# Altium schematic sheet 05-WPT.SchDoc: Wireless Power Transfer
size A2; DocumentNumber: 5; SheetNumber: 5; SheetTotal: 15
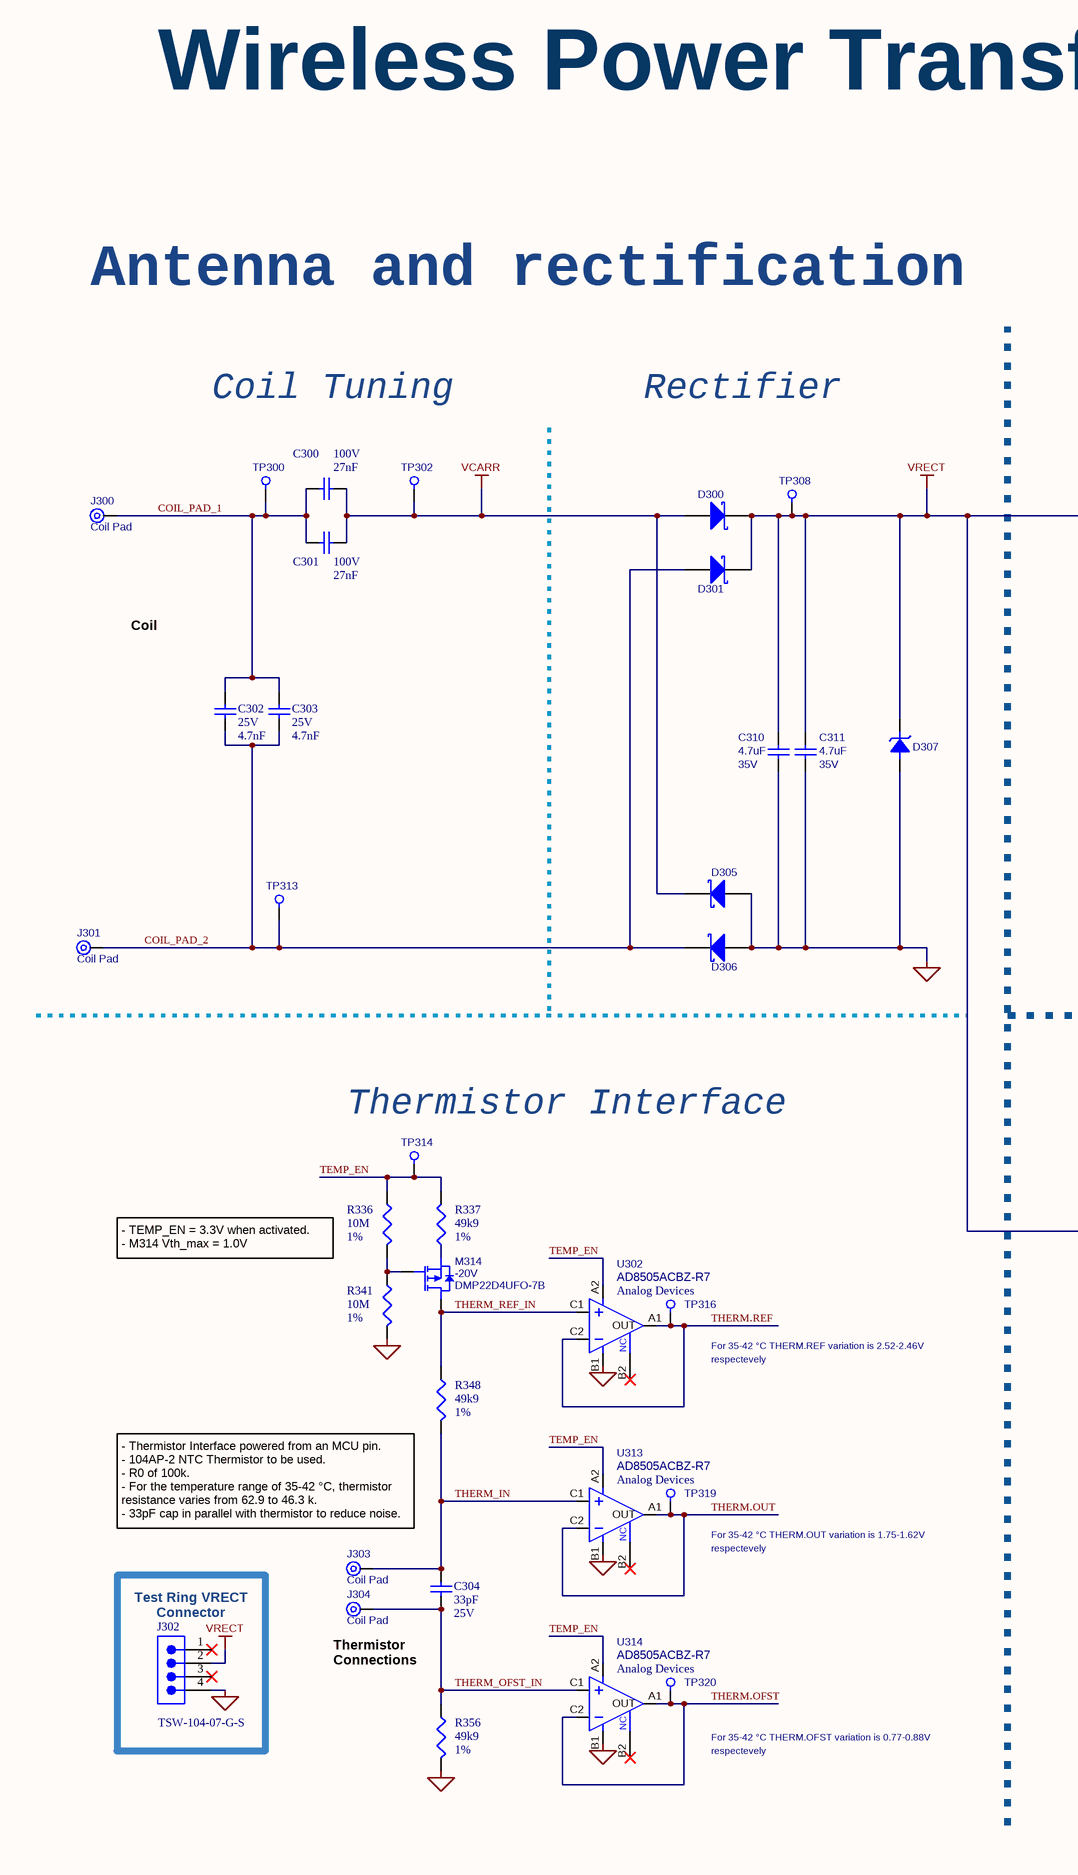
[diagram p0: 05-WPT.SchDoc, left]
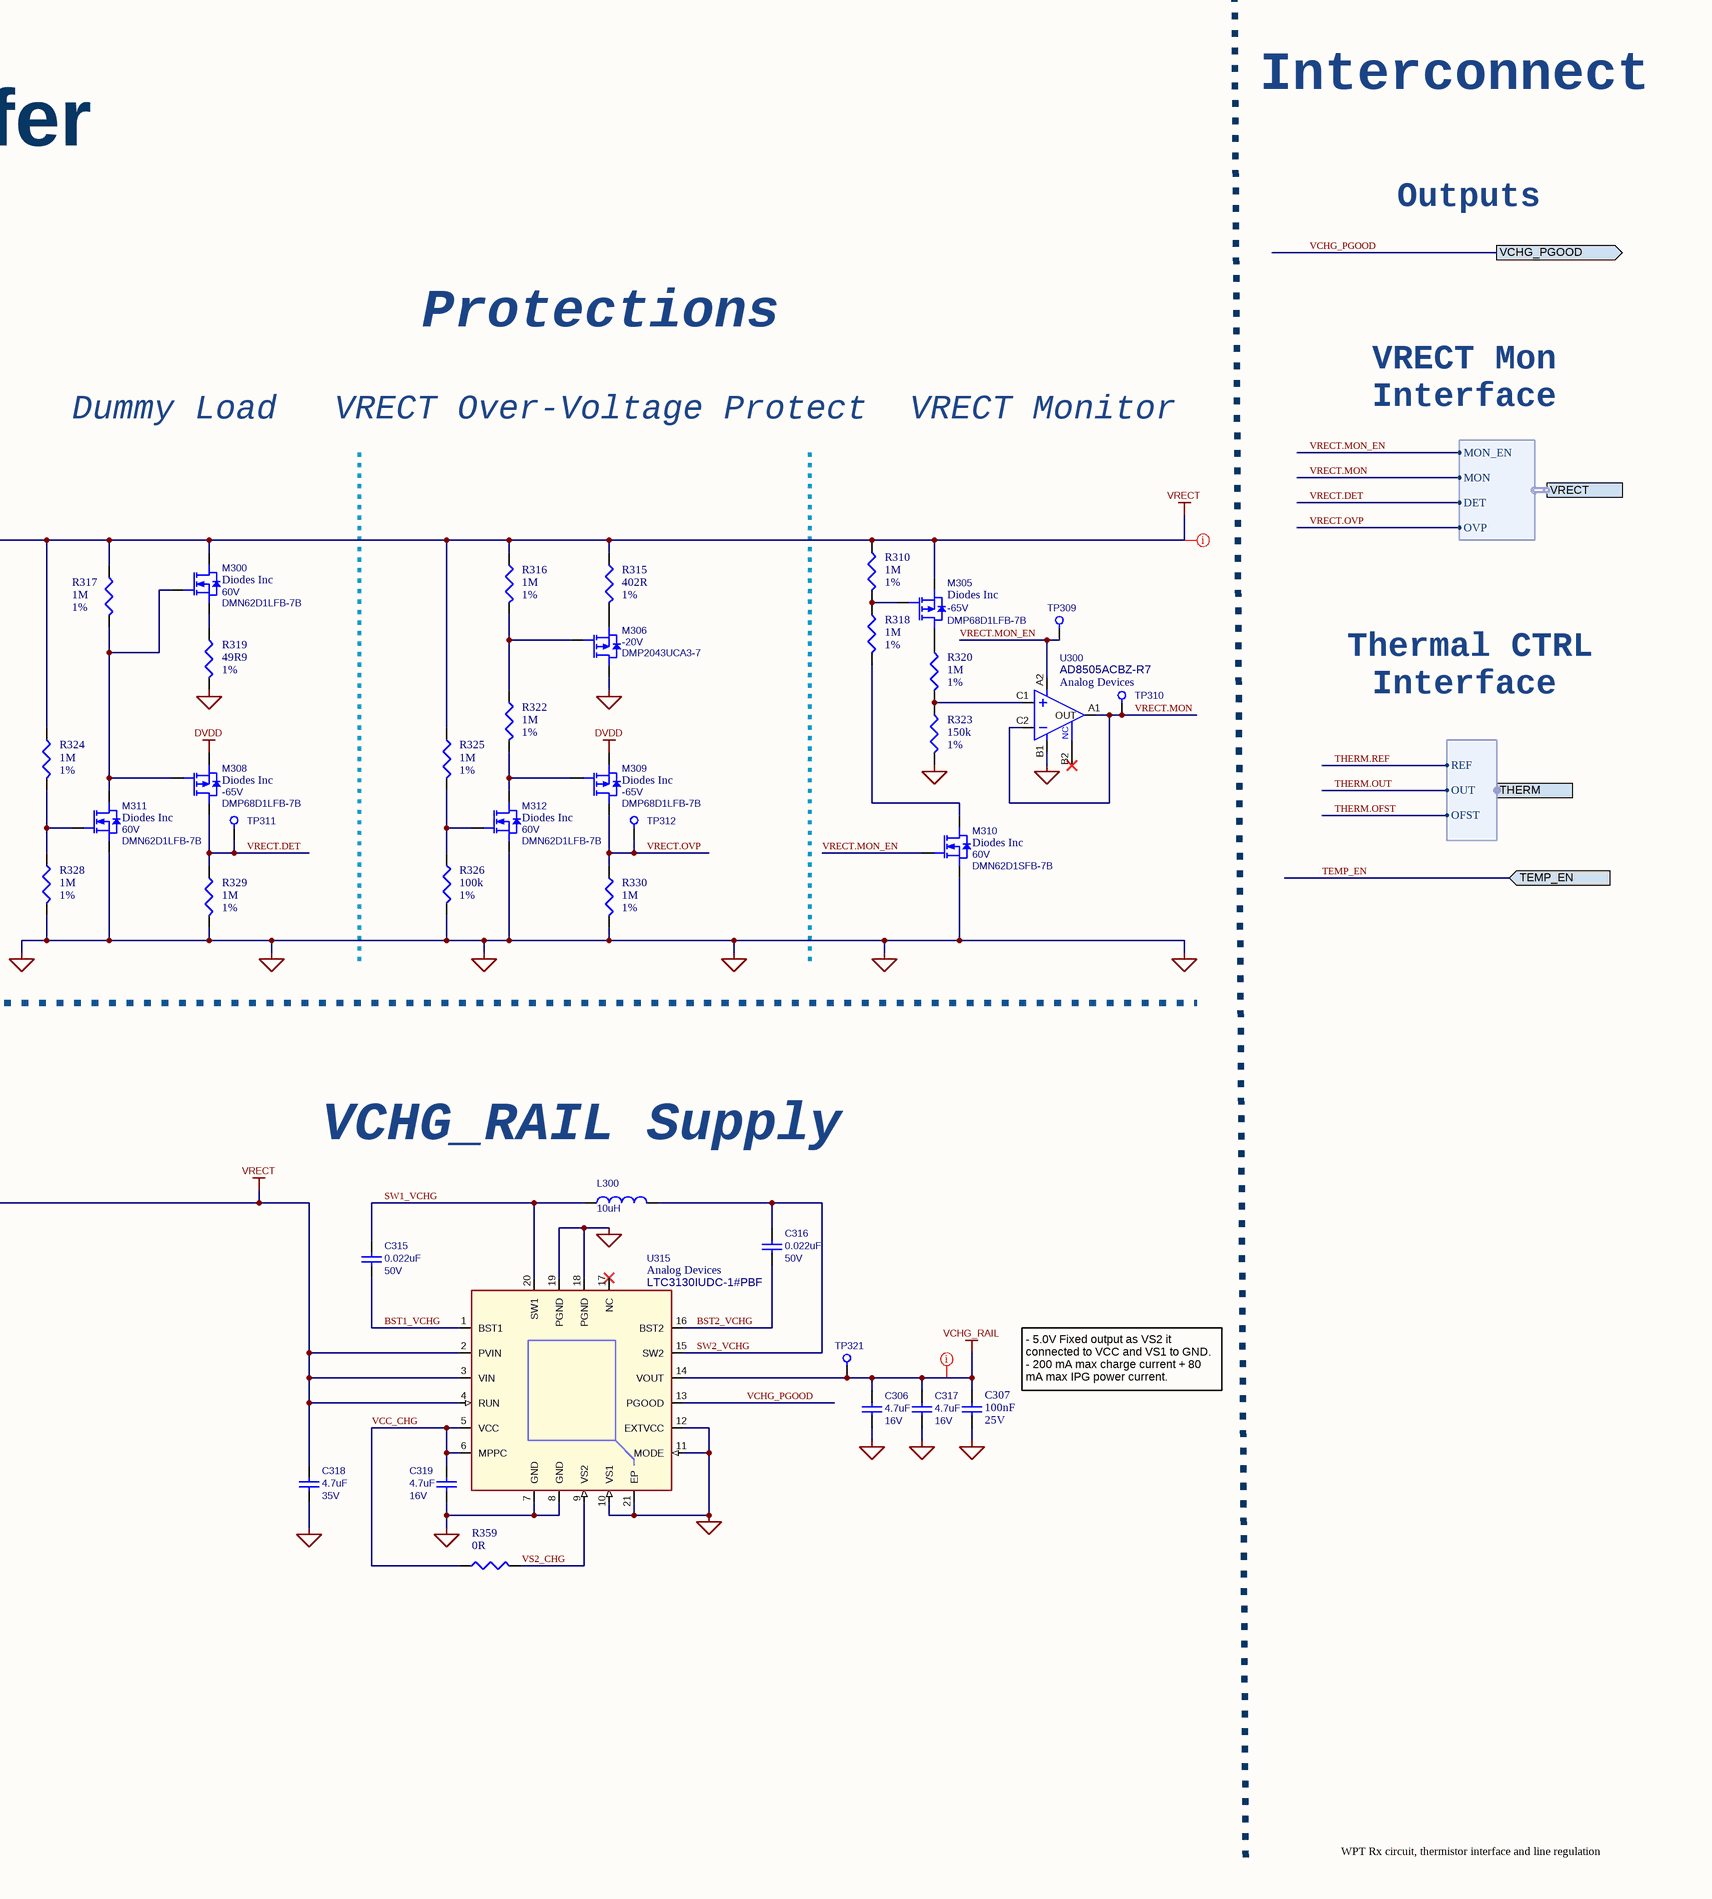
[diagram p1: 05-WPT.SchDoc, right]

## Parts
C300  value 27nF  Voltage Rating: 100V  [CAP0805_REDUCED]  (hidden comment: GRM2195C2A273GE01D)
C301  value 27nF  Voltage Rating: 100V  [CAP0805_REDUCED]  (hidden comment: GRM2195C2A273GE01D)
C302  value 4.7nF  Voltage Rating: 25V  [CAP0603_REDUCED]  (hidden comment: C0603C472F3GECTU)
C303  value 4.7nF  Voltage Rating: 25V  [CAP0603_REDUCED]  (hidden comment: C0603C472F3GECTU)
C304  value 33pF  Rated DC Voltage (URdc): 25V  [C0201_C]  (hidden comment: GRM0335C1E330JA01D)
C306  value 4.7uF  Rating: 16V  [CAP0603_REDUCED]  (hidden comment: GRM188R61C475KE11)
C307  value 100nF  Rated DC Voltage (URdc): 25V  [C0201_C]  (hidden comment: GRM033R61E104KE14J)
C310  value 4.7uF  Rating: 35V  [CAP0805_REDUCED]  (hidden comment: GCM21BC7YA475KE36L)
C311  value 4.7uF  Rating: 35V  [CAP0805_REDUCED]  (hidden comment: GCM21BC7YA475KE36L)
C315  value 0.022uF  Rating: 50V  [CAP0402_REDUCED]  (hidden comment: GCM155R71H223KA55D)
C316  value 0.022uF  Rating: 50V  [CAP0402_REDUCED]  (hidden comment: GCM155R71H223KA55D)
C317  value 4.7uF  Rating: 16V  [CAP0603_REDUCED]  (hidden comment: GRM188R61C475KE11)
C318  value 4.7uF  Rating: 35V  [CAP0805_REDUCED]  (hidden comment: GCM21BC7YA475KE36L)
C319  value 4.7uF  Rating: 16V  [CAP0603_REDUCED]  (hidden comment: GRM188R61C475KE11)
D300  NSR05T40XV2T5G  [STM_SOD-523_R]  (value not drawn)
D301  NSR05T40XV2T5G  [STM_SOD-523_R]  (value not drawn)
D305  NSR05T40XV2T5G  [STM_SOD-523_R]  (value not drawn)
D306  NSR05T40XV2T5G  [STM_SOD-523_R]  (value not drawn)
D307  BZX884B10L-G3-08  [DFN1006-2A]  (value not drawn)
J300  Coil Pad  [FEEDHOLE_20mil]  (no BOM)
J301  Coil Pad  [FEEDHOLE_20mil]  (no BOM)
J302  TSW-104-07-G-S  [SMTC-TSW-104-07-X-S]
J303  Coil Pad  [FEEDHOLE_20mil]  (no BOM)
J304  Coil Pad  [FEEDHOLE_20mil]  (no BOM)
L300  value 10uH  [WURTH_74438323100_REDUCED]  (hidden comment: 74438323100)
M300  Manufacturer: Diodes Inc  Rating: 60V  [DIODESINC_X1-DFN1006-3]  (hidden comment: DMN62D1LFB-7B)
M305  Manufacturer: Diodes Inc  Rating: -65V  [DIODESINC_X1-DFN1006-3]  (hidden comment: DMP68D1LFB-7B)
M306  Rating: -20V  [DIODESINC_X2-DSN1010-3_CUSTOMPIN]  (hidden comment: DMP2043UCA3-7)
M308  Manufacturer: Diodes Inc  Rating: -65V  [DIODESINC_X1-DFN1006-3]  (hidden comment: DMP68D1LFB-7B)
M309  Manufacturer: Diodes Inc  Rating: -65V  [DIODESINC_X1-DFN1006-3]  (hidden comment: DMP68D1LFB-7B)
M310  Manufacturer: Diodes Inc  Rating: 60V  [DIODESINC_X1-DFN1006-3]  (hidden comment: DMN62D1SFB-7B)
M311  Manufacturer: Diodes Inc  Rating: 60V  [DIODESINC_X1-DFN1006-3]  (hidden comment: DMN62D1LFB-7B)
M312  Manufacturer: Diodes Inc  Rating: 60V  [DIODESINC_X1-DFN1006-3]  (hidden comment: DMN62D1LFB-7B)
M314  Rating: -20V  [DIODESINC_X2-DFN0604-3]  (hidden comment: DMP22D4UFO-7B)
R310  value 1M  Tolerance: 1%  [R0201_C]  (hidden comment: CRCW02011M00FNED)
R315  value 402R  Tolerance: 1%  [R0201_C]  (hidden comment: CRCW0201402RFNED)
R316  value 1M  Tolerance: 1%  [R0201_C]  (hidden comment: CRCW02011M00FNED)
R317  value 1M  Tolerance: 1%  [R0201_C]  (hidden comment: CRCW02011M00FNED)
R318  value 1M  Tolerance: 1%  [R0201_C]  (hidden comment: CRCW02011M00FNED)
R319  value 49R9  Tolerance: 1%  [R0201_C]  (hidden comment: CRCW020149R9FNED)
R320  value 1M  Tolerance: 1%  [R0201_C]  (hidden comment: CRCW02011M00FNED)
R322  value 1M  Tolerance: 1%  [R0201_C]  (hidden comment: CRCW02011M00FNED)
R323  value 150k  Tolerance: 1%  [R0201_C]  (hidden comment: CRCW0201150KFNED)
R324  value 1M  Tolerance: 1%  [R0201_C]  (hidden comment: CRCW02011M00FNED)
R325  value 1M  Tolerance: 1%  [R0201_C]  (hidden comment: CRCW02011M00FNED)
R326  value 100k  Tolerance: 1%  [R0201_C]  (hidden comment: CRCW0201100KFNED)
R328  value 1M  Tolerance: 1%  [R0201_C]  (hidden comment: CRCW02011M00FNED)
R329  value 1M  Tolerance: 1%  [R0201_C]  (hidden comment: CRCW02011M00FNED)
R330  value 1M  Tolerance: 1%  [R0201_C]  (hidden comment: CRCW02011M00FNED)
R336  value 10M  Tolerance: 1%  [R0201_C]  (hidden comment: CRCW020110M0FNED)
R337  value 49k9  Tolerance: 1%  [R0201_C]  (hidden comment: CRCW020149K9FNED)
R341  value 10M  Tolerance: 1%  [R0201_C]  (hidden comment: CRCW020110M0FNED)
R348  value 49k9  Tolerance: 1%  [R0201_C]  (hidden comment: CRCW020149K9FNED)
R356  value 49k9  Tolerance: 1%  [R0201_C]  (hidden comment: CRCW020149K9FNED)
R359  value 0R  [R0201_C]  (hidden comment: CRCW02010000Z0ED)
TP300  Test Point  [testpad_0.9mm]  (value not drawn)  (no BOM)
TP302  Test Point  [testpad_0.9mm]  (value not drawn)  (no BOM)
TP308  Test Point  [testpad_0.9mm]  (value not drawn)  (no BOM)
TP309  Test Point  [testpad_0.9mm]  (value not drawn)  (no BOM)
TP310  Test Point  [testpad_0.9mm]  (value not drawn)  (no BOM)
TP311  Test Point  [testpad_0.9mm]  (value not drawn)  (no BOM)
TP312  Test Point  [testpad_0.9mm]  (value not drawn)  (no BOM)
TP313  Test Point  [testpad_0.9mm]  (value not drawn)  (no BOM)
TP314  Test Point  [testpad_0.9mm]  (value not drawn)  (no BOM)
TP316  Test Point  [testpad_0.9mm]  (value not drawn)  (no BOM)
TP319  Test Point  [testpad_0.9mm]  (value not drawn)  (no BOM)
TP320  Test Point  [testpad_0.9mm]  (value not drawn)  (no BOM)
TP321  Test Point  [testpad_0.9mm]  (value not drawn)  (no BOM)
U300  Manufacturer: Analog Devices  [AD8505ACBZ-R7]  (hidden comment: AD8505ACBZ-R7)
U302  Manufacturer: Analog Devices  [AD8505ACBZ-R7]  (hidden comment: AD8505ACBZ-R7)
U313  Manufacturer: Analog Devices  [AD8505ACBZ-R7]  (hidden comment: AD8505ACBZ-R7)
U314  Manufacturer: Analog Devices  [AD8505ACBZ-R7]  (hidden comment: AD8505ACBZ-R7)
U315  Manufacturer: Analog Devices  [LT_UDC-20_REDUCED]  (hidden comment: LTC3130IUDC-1#PBF)

## Ports
TEMP_EN (in), THERM (harness THERMAL CTRL), VCHG_PGOOD (out), VRECT (harness VRECT MON)

## Harnesses
THERMAL CTRL: REF, OUT, OFST
VRECT MON: OVP, DET, MON, MON_EN

## Nets
DVDD: M308.2(S) M309.2(S)
GND: C306.2 C307.1 C310.1 C311.1 C317.2 C318.1 C319.2 D305.2(A) D306.2(A) D307.1 J302.4 M306.1(D) M310.2(S) M311.2(S) M312.2(S) R319.2 R323.2 R326.2 R328.2 R329.2 R330.2 R341.2 R356.2 U300.B1(V-) U302.B1(V-) U313.B1(V-) U314.B1(V-) U315.7(GND) U315.8(GND) U315.10(VS1) U315.11(MODE) U315.12(EXTVCC) U315.18(PGND) U315.19(PGND) U315.21(EP)
VCARR: C300.2 C301.2 D300.2(A) D305.1(K) TP302.1
VCHG_RAIL: C306.1 C307.2 C317.1 TP321.1 U315.14(VOUT)
VRECT: C310.2 C311.2 C318.2 D300.1(K) D301.1(K) D307.2 J302.2 M300.3(D) M305.2(S) R310.1 R315.1 R316.1 R317.1 R324.1 R325.1 TP308.1 U315.2(PVIN) U315.3(VIN) U315.4(RUN)
BST1_VCHG: C315.1 U315.1(BST1)
BST2_VCHG: C316.1 U315.16(BST2)
COIL_PAD_1: C300.1 C301.1 C302.2 C303.2 J300.1 TP300.1
COIL_PAD_2: C302.1 C303.1 D301.2(A) D306.1(K) J301.1 TP313.1
SW1_VCHG: C315.2 L300.1 U315.20(SW1)
SW2_VCHG: C316.2 L300.2 U315.15(SW2)
TEMP_EN: R336.1 R337.2 TP314.1 U302.A2(V+) U313.A2(V+) U314.A2(V+) ; port TEMP_EN
THERM.OFST: TP320.1 U314.A1(OUT) U314.C2(IN-) ; port THERM.OFST
THERM.OUT: TP319.1 U313.A1(OUT) U313.C2(IN-) ; port THERM.OUT
THERM.REF: TP316.1 U302.A1(OUT) U302.C2(IN-) ; port THERM.REF
THERM_IN: C304.2 J303.1 R348.2 U313.C1(IN+)
THERM_OFST_IN: C304.1 J304.1 R356.1 U314.C1(IN+)
THERM_REF_IN: M314.3(D) R348.1 U302.C1(IN+)
VCC_CHG: C319.1 R359.1 U315.5(VCC) U315.6(MPPC)
VCHG_PGOOD: U315.13(PGOOD) ; port VCHG_PGOOD
VRECT.DET: M308.3(D) R329.1 TP311.1 ; port VRECT.DET
VRECT.MON: TP310.1 U300.A1(OUT) U300.C2(IN-) ; port VRECT.MON
VRECT.MON_EN: M310.1(G) TP309.1 U300.A2(V+) ; port VRECT.MON_EN
VRECT.OVP: M309.3(D) R330.1 TP312.1 ; port VRECT.OVP
VS2_CHG: R359.2 U315.9(VS2)
NetM300_1: M300.1(G) M308.1(G) M311.3(D) R317.2
NetM300_2: M300.2(S) R319.1
NetM305_1: M305.1(G) R310.2 R318.1
NetM305_3: M305.3(D) R320.1
NetM306_2: M306.2(G) R316.2 R322.1
NetM306_3: M306.3(S) R315.2
NetM309_1: M309.1(G) M312.3(D) R322.2
NetM310_3: M310.3(D) R318.2
NetM311_1: M311.1(G) R324.2 R328.1
NetM312_1: M312.1(G) R325.2 R326.1
NetM314_1: M314.1(G) R336.2 R341.1
NetM314_2: M314.2(S) R337.1
NetR320_2: R320.2 R323.1 U300.C1(IN+)

Not connected (* = marked no-connect by the designer): J302 1* 3*; U300 B2(NC)*; U302 B2(NC)*; U313 B2(NC)*; U314 B2(NC)*; U315 17(NC)*

## Layout directives
rule Supply Nets [Voltage = 5.000]; net class POWER: VCHG_RAIL
net class POWER; Voltage: 0-11V: VRECT

## Notes on the sheet
- Interconnect
- Wireless Power Transfer
- Outputs
- Antenna and rectification
- Protections
- Dummy Load
- VRECT Over-Voltage Protect
- VRECT Monitor
- VRECT Mon
- Interface
- Coil Tuning
- Rectifier
- Coil
  Connections
- Thermal CTRL
- (near TP314) Thermistor Interface
- VCHG_RAIL Supply
- - TEMP_EN = 3.3V when activated.
  - M314 Vth_max = 1.0V
- For 35-42 °C THERM.REF variation is 2.52-2.46V
- respectevely
- - 5.0V Fixed output as VS2 it connected to VCC and VS1 to GND.
  - 200 mA max charge current + 80 mA max IPG power current.
- - Thermistor Interface powered from an MCU pin.
  - 104AP-2 NTC Thermistor to be used.
  - R0 of 100k.
  - For the temperature range of 35-42 °C, thermistor resistance varies from 62.9 to 46.3 k.
  - 33pF cap in parallel with thermistor to reduce noise.
- For 35-42 °C THERM.OUT variation is 1.75-1.62V
- (near J302) Test Ring VRECT
  Connector
- Thermistor
  Connections
- For 35-42 °C THERM.OFST variation is 0.77-0.88V
- WPT Rx circuit, thermistor interface and line regulation
- Project:
- Schematic:
- Design by:
- Date:
- Ver:
- .
- Comments:
- Reviewed by:

## Library data of the parts
C300 C301 = GRM2195C2A273GE01D: Capacitor, 27nF, C0G, 100VDC, 2%, 0805, Implant-grade; Manufacturer: Murata; Medical Grade Manufacturer: TBD; Category: Capacitor; Temperature Coefficient: -; Manufacturer Part Number: GRM2195C2A273GE01D; Medical Grade Manufacturer Part Number: TBD; Size Code: Size Code; Supplier: TBD; Supplier Part Number: 0.85mm; Height: 1.25mm; Width: 1.25mm; Length: 2mm; Tolerance: 2%; Dielectric: C0G; Supplier 1: Mouser; Supplier Part Number 1: 81-GRM2195C2A273GE1D; Supplier 2: Digikey; Supplier Part Number 2: 490-GRM2195C2A273GE01DCT-ND; Supplier 3: Digikey; Supplier Part Number 3: 490-GRM2195C2A273GE01DDKR-ND; Supplier 4: Digikey; Supplier Part Number 4: 490-GRM2195C2A273GE01DTR-ND
C302 C303 = C0603C472F3GECTU: Capacitor, 4.7nF, C0G, 25V, 1%, 0603, Implant-grade; Manufacturer: KEMET; Medical Grade Manufacturer: TBD; Category: Capacitor; Temperature Coefficient: -; Manufacturer Part Number: C0603C472F3GECTU; Medical Grade Manufacturer Part Number: TBD; Size Code: 0805; Supplier: -; Supplier Part Number: -; Height: 0.78mm; Width: 1.25mm; Length: 2mm; Tolerance: 1%; Dielectric: C0G; Supplier 1: Mouser; Supplier Part Number 1: 80-C0603C472F3GEC
C304 = GRM0335C1E330JA01D: Ceramic Capacitor, Multilayer, Ceramic, 25V, 5% +Tol, 5% -Tol, C0G, 30ppm/Cel TC, 0.000033uF, Surface Mount, 0201; Manufacturer: Murata; Multilayer: Yes; Supplier: Digikey; Supplier Part Number: 490-10678-1-ND; Manufacturer Part Number: GRM0335C1E330JA01D; RoHS: Yes; Category: Ceramic Capacitors; Stock: 355128; Pricing: 1=0,1, 10=0,011, 50=0,0062, 100=0,0048, 500=0,0036, 1000=0,00283, 2500=0,00258, 5000=0,00237 (USD); Mounting Technology: Surface Mount; Pins: 2; Dielectric Material: Ceramic; Package Shape: Rectangular; Case/Package: 0201; Terminal Finish: Nickel; Min Operating Temperature: -55°C; Max Operating Temperature: 125°C; JESD-609 Code: e3; Capacitor Type: Ceramic; Tolerance  (fill in as +-): 5%; Package Style: SMTMeter; Packaging: Tape and Reel; Tolerance (fill in as +-): 5%; Temperature Characteristics Code: C0G; Termination: Wraparound; Length: 0.6mm; Width: 0.3mm; Height: 0.3mm; Reach SVHC Compliant: Yes; RoHS Compliant: Yes; ComponentLink1URL: https://datasheet.ciiva.com:443/pdfs/VipMasterIC/IC/MURE/MURE-S-A0004347008/MURE-S-A0004347461-1.pdf?src-supplier=IHS+Markit; ComponentLink1Description: https://datasheet.ciiva.com:443/pdfs/VipMasterIC/IC/MURE/MURE-S-A0004347008/MURE-S-A0004347461-1.pdf?src-supplier=IHS+Markit; ComponentLink2URL: https://datasheet.ciiva.com/29538/partnumbering-e-01-29538933.pdf?src-supplier=Digikey; ComponentLink2Description: https://datasheet.ciiva.com/29538/partnumbering-e-01-29538933.pdf?src-supplier=Digikey; Supplier 1: Arrow Electronics; Supplier Part Number 1: GRM0335C1E330JA01D
C306 C317 C319 = GRM188R61C475KE11: Capacitor, 4.7uF, X5R, 16V, 10%, 0603, Implant-grade; Manufacturer: Murata; Medical Grade MFR PN: GCH188R61C475KE11; Length (mm): 1.60 ±0.10; Medical Grade MFR: Murata; PCB Footprint: cap0603_reduced; Thickness (mm): 0.80 ±0.10; Width (mm): 0.80 ±0.10; Category: Capacitor; Package Description: 0603; Check: *; Supplier 1: Arrow Electronics; Supplier Part Number 1: GRM188R61C475KE11D; Status: *; Review: *; Manufacturer Part Number: GRM188R61C475KE11
C307 = GRM033R61E104KE14J: Ceramic Capacitor, Multilayer, Ceramic, 25V, 10% +Tol, 10% -Tol, X5R, 15% TC, 0.1uF, Surface Mount, 0201; Manufacturer: Murata; Multilayer: Yes; Supplier: Digikey; Supplier Part Number: 490-14571-1-ND; Manufacturer Part Number: GRM033R61E104KE14J; RoHS: Yes; Category: Ceramic Capacitors; Stock: 1540851; Pricing: 1=0,1, 10=0,033, 50=0,0192, 100=0,0148, 500=0,01118, 1000=0,00878, 2500=0,00798, 5000=0,00734 (USD); Mounting Technology: Surface Mount; Pins: 2; Dielectric Material: Ceramic; Package Shape: Rectangular; Case/Package: 0201; Terminal Finish: Nickel; Min Operating Temperature: -55°C; Max Operating Temperature: 85°C; JESD-609 Code: e3; Capacitor Type: Ceramic; Tolerance  (fill in as +-): 10%; Package Style: SMTMeter; Packaging: Tape and Reel; Tolerance (fill in as +-): 10%; Temperature Characteristics Code: X5R; Termination: Wraparound; Length: 0.6mm; Width: 0.3mm; Height: 0.3mm; Reach SVHC Compliant: Yes; RoHS Compliant: Yes; ComponentLink1URL: https://psearch.en.murata.com:443/capacitor/product/GRM033R61E104KE14%23.pdf?src-supplier=IHS+Markit; ComponentLink1Description: https://psearch.en.murata.com:443/capacitor/product/GRM033R61E104KE14%23.pdf?src-supplier=IHS+Markit; ComponentLink2URL: http://www.mouser.com/ds/2/281/c02e-2905.pdf?src-supplier=Mouser; ComponentLink2Description: http://www.mouser.com/ds/2/281/c02e-2905.pdf?src-supplier=Mouser; ComponentLink3URL: http://search.murata.co.jp/Ceramy/image/img/A01X/G101/ENG/GRM033R61E104KE14-01.pdf?src-supplier=Digikey; ComponentLink3Description: http://search.murata.co.jp/Ceramy/image/img/A01X/G101/ENG/GRM033R61E104KE14-01.pdf?src-supplier=Digikey; ComponentLink4URL: https://search.murata.co.jp/Ceramy/image/img/A01X/G101/ENG/GRM033R61E104KE14-01.pdf?src-supplier=Digikey; ComponentLink4Description: https://search.murata.co.jp/Ceramy/image/img/A01X/G101/ENG/GRM033R61E104KE14-01.pdf?src-supplier=Digikey; Supplier 1: Arrow Electronics; Supplier Part Number 1: GRM033R61E104KE14J
C310 C311 C318 = GCM21BC7YA475KE36L: Capacitor, 4.7uF, X7S, 35V, 10%, 0805, Implant-grade; Manufacturer: Murata; Medical Grade MFR PN: GCH21BC7YA475KE11; Review: 020823; Length (mm): 2.00 ±0.20; Medical Grade MFR: Murata; PCB Footprint: cap0805_reduced; Thickness (mm): 1.25 ±0.20; Width (mm): 1.25 ±0.20; Category: Capacitor; Package Description: 0805; Check: *; Supplier 1: Arrow Electronics; Supplier Part Number 1: GCM21BC7YA475KE36L; Status: Approved; Manufacturer Part Number: GCM21BC7YA475KE36L
C315 C316 = GCM155R71H223KA55D: Capacitor, 0.022uF, X7R, 50V, 10%, 0402, Implant-grade; Manufacturer: Murata; Medical Grade MFR PN: GCH155R71H223KE01; Review: 020823; Length (mm): 1.00 ±0.05; Medical Grade MFR: Murata; PCB Footprint: cap0402_reduced; Thickness (mm): 0.50 ±0.05; Width (mm): 0.50 ±0.05; Category: Capacitor; Package Description: 0402; Check: *; Supplier 1: Arrow Electronics; Supplier Part Number 1: GCM155R71H223KA55D; Status: Approved; Manufacturer Part Number: GCM155R71H223KA55
D300 D301 D305 D306 = NSR05T40XV2T5G: Schottky, 40V, 500mA, 530mV, SOD-523; Manufacturer: ON Semiconductor; Medical Grade MFR: TBD; Review: 020823; Length (mm): 1.60 ±0.10; Medical Grade MFR PN: TBD; PCB Footprint: TBD; Rating: 40V, 500mA; Thickness (mm): 0.60 ±0.10; Value: NSR05T40XV2T5G; Width (mm): 0.80 ±0.10; Category: Diode; Supplier 1: Arrow Electronics; Supplier Part Number 1: NSR05T40XV2T5G; Status: Approved; Manufacturer Part Number: NSR05T40XV2T5G
D307 = BZX884B10L-G3-08: Zener Diode 10 V 300 mW ±2% Surface Mount DFN1006-2A 0402; Manufacturer: Vishay; Medical Grade MFR: TBD; Category: Zenner Diode; Medical Grade MFR PN: TBD; Manufacturer Part Number: BZX884B10L-G3-08; Supplier 1: Digikey; Supplier Part Number 1: 112-BZX884B10L-G3-08CT-ND
J300 J301 J303 J304 = Coil Pad: Coil TH pad, hole size and ring TBD; Value: Coil Solder Pad; Category: Coil Solder Pad; Length (mm): TBD; Manufacturer: N/A; Manufacturer PN: N/A; Medical Grade MFR: N/A; Medical Grade MFR PN: N/A; PCB Footprint: TBD; Rating: N/A; Thickness (mm): N/A; Width (mm): TBD; Package Description: N/A; Status: *; Review: *
J302 = TSW-104-07-G-S: Board Connector, 4 Contact(s), 1 Row(s), Male, Straight, 0.1 inch Pitch, Solder Terminal, Black Insulator, Receptacle; Manufacturer: Samtec; PartNumber: TSW-106-07-G-S; Pitch: 2.54 mm; Option: General Purpose; Filter Feature: No; Number of Rows Loaded: 1; Number of Contacts: 4; Additional Feature: E.L.P.; Contact Pattern: RECTANGULAR; Contact Style: SQ PIN-SKT; Mating Information: MULTIPLE MATING PARTS AVAILABLE; Plating Thickness: 10uin; Reference Standard: UL; Reliability: COMMERCIAL; RoHS: True; ComponentLink1Description: Manufacturer URL; DatasheetVersion: F-214; Orientation: Vertical; ComponentLink1URL: http://www.samtec.com; ComponentLink3Description: Package Specification; ComponentLink2Description: Datasheet; PackageVersion: DM, 8/1988; PackageDescription: .025[0.64] SQ. Post Terminal Strip Assembly; PackageReference: TSW-106-07-X-S; Mounting Technology: Through-hole; Temperature Range: -55 to 125 degC; ComponentLink3URL: http://www.samtec.com/documents/webfiles/cpdf/TSW-XXX-XX-XXX-X-XX-XXX-MKT.pdf; ComponentLink2URL: http://www.samtec.com/documents/webfiles/pdf/TSW_TH.PDF; Supplier: Arrow Electronics; Supplier Part Number: TSW-104-07-G-S; Manufacturer Part Number: TSW-104-07-G-S; Category: Board to Board Connectors; Stock: 5100; Pricing: 1=0,59, 50=0,46, 100=0,37, 500=0,32, 1000=0,24, 2000=0,21, 5000=0,15 (USD); Contact Finish - Termination: Gold (Au) - with Nickel (Ni) barrier; Contact Material: Bronze; Contact Finish - Mating: GOLD (10) OVER NICKEL (50); Insulation Color: Black; Insulation Material: Glass; Connector Type: BOARD CONNECTOR; JESD-609 Code: e4; Contact Gender: Male; Mixed Contacts: No; Mounting Style: STRAIGHT; Termination: Solder; Number Of Connectors: 1; Number Of PCB Rows: 1; PCB Contact Pattern: RECTANGULAR; Body/Shell Style: RECEPTACLE; Terminal Pitch: 2.54mm; Mating Contact Pitch: 0.1inch; Body Breadth: 0.1inch; Body Depth: 0.1inch; Terminal Length: 0.1inch; Flammability Rating: UL94 V-0; DIN Conformance: No; IEC Conformance: No; MIL Conformance: No; Reach SVHC Compliant: Yes; RoHS Compliant: Yes; ComponentLink4URL: https://datasheet.ciiva.com:443/pdfs/VipMasterIC/IC/SAMI/SAMI-S-A0003531373/SAMI-S-A0003531373-1.pdf?src-supplier=IHS+Markit; ComponentLink4Description: https://datasheet.ciiva.com:443/pdfs/VipMasterIC/IC/SAMI/SAMI-S-A0003531373/SAMI-S-A0003531373-1.pdf?src-supplier=IHS+Markit; ComponentLink5URL: https://datasheet.ciiva.com/6889/tsw-xxx-xx-xxx-x-xx-xxx-mkt-6889291.pdf?src-supplier=Digi-Key; ComponentLink5Description: https://datasheet.ciiva.com/6889/tsw-xxx-xx-xxx-x-xx-xxx-mkt-6889291.pdf?src-supplier=Digi-Key; Supplier 1: Digikey; Supplier Part Number 1: SAM1029-04-ND
L300 = 74438323100: Inductor, 10uH, 600mA, 20%, 1008; Manufacturer: Wurth; Medical Grade MFR: TBD; Review: 020823; Length (mm): 2.50 ±0.20; Medical Grade MFR PN: TBD; PCB Footprint: TBD; Rating: 600mA; Thickness (mm): 1.00; Width (mm): 2.00 ±0.20; Category: Inductor; Supplier 1: Rs; Supplier Part Number 1: 7922736P; Status: Approved; Manufacturer Part Number: 74438323100
M300 M311 M312 = DMN62D1LFB-7B: MOSFET, N-Chan, 60V, 320mA, DFN1006; Medical Grade MFR: TBD; Review: 020823; Category: Transistor; Length (mm): 1.00 ±0.08; Medical Grade MFR PN: TBD; PCB Footprint: TBD; Thickness (mm): 0.50 ±0.03; Width (mm): 0.60 ±0.08; Value: DMN62D1LFB-7B; Supplier 1: Digi-Key; Supplier Part Number 1: DMN62D1LFB-7BDICT-ND; Status: Approved; Manufacturer Part Number: DMN62D1LFB-7B
M305 M308 M309 = DMP68D1LFB-7B: MOSFET, P-chan, -65V, -290mA, DFN1006; Medical Grade MFR: TBD; Review: 020823; Category: Transistor; Length (mm): 1.00 ±0.08; Medical Grade MFR PN: TBD; PCB Footprint: DFN1006; Thickness (mm): 0.50 ±0.03; Width (mm): 0.60 ±0.08; Supplier 1: Mouser; Supplier Part Number 1: 621-DMP68D1LFB-7B; Value: DMP68D1LFB-7B; Manufacturer Part Number: DMP68D1LFB
M306 = DMP2043UCA3-7: MOSFET, P-chan, -20V, -3.4A, DFN1010-3; Manufacturer: Diodes Inc; Medical Grade MFR: TBD; Category: Transistor; Length (mm): 0.96 ±0.04; Medical Grade MFR PN: TBD; PCB Footprint: TBD; Thickness (mm): 0.32 ±0.03; Value: DMP2043UCA3-7; Width (mm): 0.96 ±0.04; Supplier 1: Digi-Key; Supplier Part Number 1: 31-DMP2043UCA3-7CT-ND; Status: *; Review: *; Manufacturer Part Number: DMP2043UCA3-7
M310 = DMN62D1SFB-7B: MOSFET, N-Chan, 60V, 300mA, DFN1006; Medical Grade MFR: TBD; Review: 020823; Category: Transistor; Length (mm): 1.00 ±0.08; Medical Grade MFR PN: TBD; PCB Footprint: TBD; Thickness (mm): 0.50 ±0.03; Width (mm): 0.60 ±0.08; Value: DMN62D1SFB-7B; Supplier 1: Digi-Key; Supplier Part Number 1: DMN62D1SFB-7BDICT-ND; Status: Approved; Manufacturer Part Number: DMN62D1SFB-7B
M314 = DMP22D4UFO-7B: MOSFET, P-chan, -20V, -383mA, DFN0604; Manufacturer: Diodes Inc; Medical Grade MFR: TBD; Review: 020823; Category: Transistor; Length (mm): 0.60 ±0.05; Medical Grade MFR PN: TBD; PCB Footprint: TBD; Thickness (mm): 0.36 ±0.04; Value: DMP22D4UFO-7B; Width (mm): 0.40 ±0.05; Supplier 1: Digi-Key; Supplier Part Number 1: 31-DMP22D4UFO-7BCT-ND; Status: Approved; Manufacturer Part Number: DMP22D4UFO-7B
R310 R316-R318 R320 R322 R324 R325 R328-R330 = CRCW02011M00FNED: Fixed Resistor, Metal Glaze/thick Film, 0.05W, 1000000ohm, 30V, 1% +/-Tol, 200ppm/Cel, Surface Mount, 0201; Manufacturer: Vishay; Medical Grade MFR: Mini-Systems; Medical Grade MFR PN: MWA96SM-1004F-NS62TR; Power: 50mW; Rated Temperature: 70°C; Temperature Coefficient: 200ppm/°C; Package Height: 0.23mm; Package Length: 0.6mm; Package Width: 0.3mm; Reference Standard: AEC-Q200; Category: Chip SMD Resistors; Supplier: Digikey; Supplier Part Number: 541-1.00MABCT-ND; Manufacturer Part Number: CRCW02011M00FNED; RoHS: Yes; Stock: 392914; Pricing: 1=0,1, 10=0,037, 50=0,0242, 100=0,0204, 500=0,01426, 1000=0,01241, 5000=0,00924 (USD); Mounting Technology: Surface Mount; Pins: 2; Package Shape: Rectangular; Case/Package: 0201; Terminal Finish: Nickel; Min Operating Temperature: -55°C; Max Operating Temperature: 155°C; JESD-609 Code: e3; Resistor Type: FIXED RESISTOR; Construction: Chip; Package Style: SMTMeter; Packaging: Tape and Reel; Technology: METAL GLAZE/THICK FILM; Termination: Wraparound; Working Voltage: 30V; Reach SVHC Compliant: Yes; RoHS Compliant: Yes; ComponentLink1URL: https://datasheet.ciiva.com:443/pdfs/VipMasterIC/IC/VISH/VISH-S-A0002932828/VISH-S-A0002932828-1.pdf?src-supplier=IHS+Markit; ComponentLink1Description: https://datasheet.ciiva.com:443/pdfs/VipMasterIC/IC/VISH/VISH-S-A0002932828/VISH-S-A0002932828-1.pdf?src-supplier=IHS+Markit; ComponentLink2URL: https://datasheet.ciiva.com/7841/1719906-7841438.pdf?src-supplier=Element14; ComponentLink2Description: https://datasheet.ciiva.com/7841/1719906-7841438.pdf?src-supplier=Element14; ComponentLink3URL: https://datasheet.ciiva.com/7841/1719906-7841439.pdf?src-supplier=Element14; ComponentLink3Description: https://datasheet.ciiva.com/7841/1719906-7841439.pdf?src-supplier=Element14; ComponentLink4URL: https://datasheet.ciiva.com/7859/dcrcwe3-7859689.pdf?src-supplier=Element14; ComponentLink4Description: https://datasheet.ciiva.com/7859/dcrcwe3-7859689.pdf?src-supplier=Element14; ComponentLink5URL: https://datasheet.ciiva.com/16757/70202042-16757675.pdf?src-supplier=Allied+Electronics; ComponentLink5Description: https://datasheet.ciiva.com/16757/70202042-16757675.pdf?src-supplier=Allied+Electronics; ComponentLink6URL: https://datasheet.ciiva.com/22692/1719906-22692761.pdf?src-supplier=Element14; ComponentLink6Description: https://datasheet.ciiva.com/22692/1719906-22692761.pdf?src-supplier=Element14; ComponentLink7URL: https://datasheet.ciiva.com/9109/crcw0201e3-9109910.pdf?src-supplier=Avnet; ComponentLink7Description: https://datasheet.ciiva.com/9109/crcw0201e3-9109910.pdf?src-supplier=Avnet; ComponentLink8URL: https://datasheet.ciiva.com/22675/1847332-22675065.pdf?src-supplier=Element14; ComponentLink8Description: https://datasheet.ciiva.com/22675/1847332-22675065.pdf?src-supplier=Element14; ComponentLink9URL: https://datasheet.ciiva.com/2474/crcw0201e3-2474824.pdf?src-supplier=Digikey; ComponentLink9Description: https://datasheet.ciiva.com/2474/crcw0201e3-2474824.pdf?src-supplier=Digikey; ComponentLink10URL: https://datasheet.ciiva.com/2474/crcw0201e3-2474825.pdf?src-supplier=Digikey; ComponentLink10Description: https://datasheet.ciiva.com/2474/crcw0201e3-2474825.pdf?src-supplier=Digikey; ComponentLink11URL: https://datasheet.ciiva.com/2474/crcw0201e3-2474826.pdf?src-supplier=Digikey; ComponentLink11Description: https://datasheet.ciiva.com/2474/crcw0201e3-2474826.pdf?src-supplier=Digikey; Supplier 1: Digikey; Supplier Part Number 1: 541-1.00MABCT-ND
R315 = CRCW0201402RFNED: Fixed Resistor, Metal Glaze/thick Film, 0.05W, 402ohm, 30V, 1% +/-Tol, 200ppm/Cel, Surface Mount, 0201; Manufacturer: Vishay; Medical Grade MFR: Mini-Systems; Medical Grade MFR PN: MWA96SM-4020F-NS62TR; Power: 50mW; Rated Temperature: 70°C; Temperature Coefficient: 200ppm/°C; Package Height: 0.23mm; Package Length: 0.6mm; Package Width: 0.3mm; Reference Standard: AEC-Q200; Category: Chip SMD Resistors; Supplier: Digikey; Supplier Part Number: 541-CRCW0201402RFNEDCT-ND; Manufacturer Part Number: CRCW0201402RFNED; RoHS: Yes; Stock: 69102; Pricing: 1=0,1, 10=0,037, 50=0,0242, 100=0,0204, 500=0,01426, 1000=0,01241, 5000=0,00924 (USD); Mounting Technology: Surface Mount; Pins: 2; Package Shape: Rectangular; Case/Package: 0201; Terminal Finish: Nickel; Min Operating Temperature: -55°C; Max Operating Temperature: 155°C; JESD-609 Code: e3; Resistor Type: FIXED RESISTOR; Construction: Chip; Package Style: SMTMeter; Packaging: Tape and Reel; Technology: METAL GLAZE/THICK FILM; Termination: Wraparound; Working Voltage: 30V; Reach SVHC Compliant: Yes; RoHS Compliant: Yes; ComponentLink1URL: https://datasheet.ciiva.com:443/pdfs/VipMasterIC/IC/VISH/VISH-S-A0002932828/VISH-S-A0002932828-1.pdf?src-supplier=IHS+Markit; ComponentLink1Description: https://datasheet.ciiva.com:443/pdfs/VipMasterIC/IC/VISH/VISH-S-A0002932828/VISH-S-A0002932828-1.pdf?src-supplier=IHS+Markit; ComponentLink2URL: https://datasheet.ciiva.com/7881/1719906-7881798.pdf?src-supplier=Element14; ComponentLink2Description: https://datasheet.ciiva.com/7881/1719906-7881798.pdf?src-supplier=Element14; ComponentLink3URL: https://datasheet.ciiva.com/7881/1719906-7881799.pdf?src-supplier=Element14; ComponentLink3Description: https://datasheet.ciiva.com/7881/1719906-7881799.pdf?src-supplier=Element14; ComponentLink4URL: https://datasheet.ciiva.com/2577/crcw0201e3-2577154.pdf?src-supplier=Digikey; ComponentLink4Description: https://datasheet.ciiva.com/2577/crcw0201e3-2577154.pdf?src-supplier=Digikey; ComponentLink5URL: https://datasheet.ciiva.com/8939/crcw0201e3-8939131.pdf?src-supplier=Avnet; ComponentLink5Description: https://datasheet.ciiva.com/8939/crcw0201e3-8939131.pdf?src-supplier=Avnet; ComponentLink6URL: https://datasheet.ciiva.com/22676/1700795-22676524.pdf?src-supplier=Element14; ComponentLink6Description: https://datasheet.ciiva.com/22676/1700795-22676524.pdf?src-supplier=Element14; Supplier 1: Digikey; Supplier Part Number 1: 541-CRCW0201402RFNEDCT-ND
R319 = CRCW020149R9FNED: Fixed Resistor, Metal Glaze/thick Film, 0.05W, 49.9ohm, 30V, 1% +/-Tol, 200ppm/Cel, Surface Mount, 0201; Manufacturer: Vishay; Medical Grade MFR: Mini-Systems; Medical Grade MFR PN: MWA96SM-0500F-NS62TR; Power: 50mW; Rated Temperature: 70°C; Temperature Coefficient: 200ppm/°C; Package Height: 0.23mm; Package Length: 0.6mm; Package Width: 0.3mm; Reference Standard: AEC-Q200; Category: Chip SMD Resistors; Supplier: Digikey; Supplier Part Number: 541-49.9ABCT-ND; Manufacturer Part Number: CRCW020149R9FNED; RoHS: Yes; Stock: 372758; Pricing: 1=0,1, 10=0,037, 50=0,0242, 100=0,0204, 500=0,01426, 1000=0,01241, 5000=0,00924 (USD); Mounting Technology: Surface Mount; Pins: 2; Package Shape: Rectangular; Case/Package: 0201; Terminal Finish: Nickel; Min Operating Temperature: -55°C; Max Operating Temperature: 155°C; JESD-609 Code: e3; Termination: Wraparound; Resistor Type: FIXED RESISTOR; Construction: Chip; Package Style: SMTMeter; Packaging: Tape and Reel; Technology: METAL GLAZE/THICK FILM; Working Voltage: 30V; Reach SVHC Compliant: Yes; RoHS Compliant: Yes; ComponentLink1URL: https://datasheet.ciiva.com:443/pdfs/VipMasterIC/IC/VISH/VISH-S-A0002932828/VISH-S-A0002932828-1.pdf?src-supplier=IHS+Markit; ComponentLink1Description: https://datasheet.ciiva.com:443/pdfs/VipMasterIC/IC/VISH/VISH-S-A0002932828/VISH-S-A0002932828-1.pdf?src-supplier=IHS+Markit; Supplier 1: Digikey; Supplier Part Number 1: 541-49.9ABCT-ND
R323 = CRCW0201150KFNED: Fixed Resistor, Metal Glaze/thick Film, 0.05W, 150000ohm, 30V, 1% +/-Tol, 200ppm/Cel, Surface Mount, 0201; Manufacturer: Vishay; Medical Grade MFR: Mini-Systems; Medical Grade MFR PN: MWA96SM-1503F-NS62TR; Power: 50mW; Rated Temperature: 70°C; Temperature Coefficient: 200ppm/°C; Package Height: 0.23mm; Package Length: 0.6mm; Package Width: 0.3mm; Reference Standard: AEC-Q200; Category: Chip SMD Resistors; Supplier: Digikey; Supplier Part Number: 541-CRCW0201150KFNEDCT-ND; Manufacturer Part Number: CRCW0201150KFNED; RoHS: Yes; Stock: 35009; Pricing: 1=0,1, 10=0,037, 50=0,0242, 100=0,0204, 500=0,01426, 1000=0,01241, 5000=0,00924 (USD); Mounting Technology: Surface Mount; Pins: 2; Package Shape: Rectangular; Case/Package: 0201; Terminal Finish: Nickel; Min Operating Temperature: -55°C; Max Operating Temperature: 155°C; JESD-609 Code: e3; Resistor Type: FIXED RESISTOR; Construction: Chip; Package Style: SMTMeter; Packaging: Tape and Reel; Technology: METAL GLAZE/THICK FILM; Termination: Wraparound; Working Voltage: 30V; Reach SVHC Compliant: Yes; RoHS Compliant: Yes; ComponentLink1URL: https://datasheet.ciiva.com:443/pdfs/VipMasterIC/IC/VISH/VISH-S-A0002932828/VISH-S-A0002932828-1.pdf?src-supplier=IHS+Markit; ComponentLink1Description: https://datasheet.ciiva.com:443/pdfs/VipMasterIC/IC/VISH/VISH-S-A0002932828/VISH-S-A0002932828-1.pdf?src-supplier=IHS+Markit; ComponentLink2URL: https://datasheet.ciiva.com/7673/1719906-7673181.pdf?src-supplier=Element14; ComponentLink2Description: https://datasheet.ciiva.com/7673/1719906-7673181.pdf?src-supplier=Element14; ComponentLink3URL: https://datasheet.ciiva.com/7673/1719906-7673182.pdf?src-supplier=Element14; ComponentLink3Description: https://datasheet.ciiva.com/7673/1719906-7673182.pdf?src-supplier=Element14; ComponentLink4URL: https://datasheet.ciiva.com/2577/crcw0201e3-2577323.pdf?src-supplier=Digikey; ComponentLink4Description: https://datasheet.ciiva.com/2577/crcw0201e3-2577323.pdf?src-supplier=Digikey; ComponentLink5URL: https://datasheet.ciiva.com/8968/crcw0201e3-8968685.pdf?src-supplier=Avnet; ComponentLink5Description: https://datasheet.ciiva.com/8968/crcw0201e3-8968685.pdf?src-supplier=Avnet; ComponentLink6URL: https://datasheet.ciiva.com/22692/1719906-22692733.pdf?src-supplier=Element14; ComponentLink6Description: https://datasheet.ciiva.com/22692/1719906-22692733.pdf?src-supplier=Element14; Supplier 1: Digikey; Supplier Part Number 1: 541-CRCW0201150KFNEDDKR-ND
R326 = CRCW0201100KFNED: Fixed Resistor, Metal Glaze/thick Film, 0.05W, 100000ohm, 30V, 1% +/-Tol, 200ppm/Cel, Surface Mount, 0201; Manufacturer: Vishay; Medical Grade MFR: Mini-Systems; Medical Grade MFR PN: MWA96SM-1003F-NS62TR; Power: 50mW; Rated Temperature: 70°C; Temperature Coefficient: 200ppm/°C; Package Height: 0.23mm; Package Length: 0.6mm; Package Width: 0.3mm; Reference Standard: AEC-Q200; Category: Chip SMD Resistors; Supplier: Digikey; Supplier Part Number: 541-100KABCT-ND; Manufacturer Part Number: CRCW0201100KFNED; RoHS: Yes; Stock: 8252; Pricing: 1=0,1, 10=0,037, 50=0,0242, 100=0,0204, 500=0,01426, 1000=0,01241, 5000=0,00924 (USD); Mounting Technology: Surface Mount; Pins: 2; Package Shape: Rectangular; Case/Package: 0201; Terminal Finish: Nickel; Min Operating Temperature: -55°C; Max Operating Temperature: 155°C; JESD-609 Code: e3; Resistor Type: FIXED RESISTOR; Construction: Chip; Package Style: SMTMeter; Packaging: Tape and Reel; Technology: METAL GLAZE/THICK FILM; Termination: Wraparound; Working Voltage: 30V; Reach SVHC Compliant: Yes; RoHS Compliant: Yes; ComponentLink1URL: https://datasheet.ciiva.com:443/pdfs/VipMasterIC/IC/VISH/VISH-S-A0002932828/VISH-S-A0002932828-1.pdf?src-supplier=IHS+Markit; ComponentLink1Description: https://datasheet.ciiva.com:443/pdfs/VipMasterIC/IC/VISH/VISH-S-A0002932828/VISH-S-A0002932828-1.pdf?src-supplier=IHS+Markit; ComponentLink2URL: https://datasheet.ciiva.com/2474/crcw0201e3-2474797.pdf?src-supplier=Digikey; ComponentLink2Description: https://datasheet.ciiva.com/2474/crcw0201e3-2474797.pdf?src-supplier=Digikey; ComponentLink3URL: https://datasheet.ciiva.com/2474/crcw0201e3-2474798.pdf?src-supplier=Digikey; ComponentLink3Description: https://datasheet.ciiva.com/2474/crcw0201e3-2474798.pdf?src-supplier=Digikey; ComponentLink4URL: https://datasheet.ciiva.com/2474/crcw0201e3-2474799.pdf?src-supplier=Digikey; ComponentLink4Description: https://datasheet.ciiva.com/2474/crcw0201e3-2474799.pdf?src-supplier=Digikey; ComponentLink5URL: https://datasheet.ciiva.com/16436/dcrcwe3-16436220.pdf?src-supplier=Future+Electronics; ComponentLink5Description: https://datasheet.ciiva.com/16436/dcrcwe3-16436220.pdf?src-supplier=Future+Electronics; ComponentLink6URL: https://datasheet.ciiva.com/28634/1847332-28634462.pdf?src-supplier=Element14; ComponentLink6Description: https://datasheet.ciiva.com/28634/1847332-28634462.pdf?src-supplier=Element14; ComponentLink7URL: https://datasheet.ciiva.com/22665/1700795-22665689.pdf?src-supplier=Element14; ComponentLink7Description: https://datasheet.ciiva.com/22665/1700795-22665689.pdf?src-supplier=Element14; ComponentLink8URL: https://datasheet.ciiva.com/22870/70202042-22870476.pdf?src-supplier=Allied+Electronics; ComponentLink8Description: https://datasheet.ciiva.com/22870/70202042-22870476.pdf?src-supplier=Allied+Electronics; ComponentLink9URL: https://datasheet.ciiva.com/16777/70202042-16777655.pdf?src-supplier=Allied+Electronics; ComponentLink9Description: https://datasheet.ciiva.com/16777/70202042-16777655.pdf?src-supplier=Allied+Electronics; Supplier 1: Digikey; Supplier Part Number 1: 541-100KABCT-ND
R336 R341 = CRCW020110M0FNED: Fixed Resistor, Metal Glaze/thick Film, 0.05W, 10000000ohm, 30V, 1% +/-Tol, 200ppm/Cel, Surface Mount, 0201; Manufacturer: Vishay Draloric; Medical Grade MFR: Mini-Systems; Medical Grade MFR PN: MWA96SM-1005F-NS62TR; Power: 50mW; Rated Temperature: 70°C; Temperature Coefficient: 200ppm/°C; Category: Chip SMD Resistors; Supplier: Mouser; Supplier Part Number: 71-CRCW020110M0FNED; Manufacturer Part Number: CRCW020110M0FNED; RoHS: Yes; Stock: 159754; Pricing: 1=0,1, 10=0,024, 50=0,024, 100=0,014, 1000=0,011, 10000=0,006 (USD); Mounting Technology: Surface Mount; Pins: 2; Package Shape: Rectangular; Case/Package: 0201; Terminal Finish: Nickel; Min Operating Temperature: -55°C; Max Operating Temperature: 155°C; JESD-609 Code: e3; Resistor Type: FIXED RESISTOR; Packaging: Tape and Reel; Technology: METAL GLAZE/THICK FILM; Termination: Wraparound; Working Voltage: 30V; Reach SVHC Compliant: Yes; RoHS Compliant: Yes; ComponentLink1URL: https://datasheet.ciiva.com:443/pdfs/VipMasterIC/IC/VISH/VISH-S-A0002932828/VISH-S-A0002932828-1.pdf?src-supplier=IHS+Markit; ComponentLink1Description: https://datasheet.ciiva.com:443/pdfs/VipMasterIC/IC/VISH/VISH-S-A0002932828/VISH-S-A0002932828-1.pdf?src-supplier=IHS+Markit; ComponentLink2URL: https://datasheet.ciiva.com/7673/1719906-7673177.pdf?src-supplier=Element14; ComponentLink2Description: https://datasheet.ciiva.com/7673/1719906-7673177.pdf?src-supplier=Element14; ComponentLink3URL: https://datasheet.ciiva.com/7673/1719906-7673178.pdf?src-supplier=Element14; ComponentLink3Description: https://datasheet.ciiva.com/7673/1719906-7673178.pdf?src-supplier=Element14; ComponentLink4URL: https://datasheet.ciiva.com/22692/1719906-22692711.pdf?src-supplier=Element14; ComponentLink4Description: https://datasheet.ciiva.com/22692/1719906-22692711.pdf?src-supplier=Element14; ComponentLink5URL: https://datasheet.ciiva.com/22665/1700795-22665701.pdf?src-supplier=Element14; ComponentLink5Description: https://datasheet.ciiva.com/22665/1700795-22665701.pdf?src-supplier=Element14; Supplier 1: Digikey; Supplier Part Number 1: 541-CRCW020110M0FNEDCT-ND
R337 R348 R356 = CRCW020149K9FNED: Fixed Resistor, Metal Glaze/thick Film, 0.05W, 49900ohm, 30V, 1% +/-Tol, 200ppm/Cel, Surface Mount, 0201; Manufacturer: Vishay; Medical Grade MFR: Mini-Systems; Medical Grade MFR PN: MWA96SM-4992F-NS62TR; Power: 50mW; Rated Temperature: 70°C; Temperature Coefficient: 200ppm/°C; Package Height: 0.23mm; Package Length: 0.6mm; Package Width: 0.3mm; Reference Standard: AEC-Q200; Supplier: Digikey; Supplier Part Number: 541-49.9KABCT-ND; Manufacturer Part Number: CRCW020149K9FNED; RoHS: Yes; Category: Chip SMD Resistors; Stock: 25072; Pricing: 1=0,1, 10=0,037, 50=0,0242, 100=0,0204, 500=0,01426, 1000=0,01241, 5000=0,00924 (USD); Mounting Technology: Surface Mount; Pins: 2; Package Shape: Rectangular; Case/Package: 0201; Terminal Finish: Nickel; Min Operating Temperature: -55°C; Max Operating Temperature: 155°C; JESD-609 Code: e3; Resistor Type: FIXED RESISTOR; Construction: Chip; Package Style: SMTMeter; Packaging: Tape and Reel; Technology: METAL GLAZE/THICK FILM; Termination: Wraparound; Working Voltage: 30V; Reach SVHC Compliant: Yes; RoHS Compliant: Yes; ComponentLink1URL: https://datasheet.ciiva.com:443/pdfs/VipMasterIC/IC/VISH/VISH-S-A0002932828/VISH-S-A0002932828-1.pdf?src-supplier=IHS+Markit; ComponentLink1Description: https://datasheet.ciiva.com:443/pdfs/VipMasterIC/IC/VISH/VISH-S-A0002932828/VISH-S-A0002932828-1.pdf?src-supplier=IHS+Markit; ComponentLink2URL: https://datasheet.ciiva.com/7673/1719906-7673210.pdf?src-supplier=Element14; ComponentLink2Description: https://datasheet.ciiva.com/7673/1719906-7673210.pdf?src-supplier=Element14; ComponentLink3URL: https://datasheet.ciiva.com/7673/1719906-7673209.pdf?src-supplier=Element14; ComponentLink3Description: https://datasheet.ciiva.com/7673/1719906-7673209.pdf?src-supplier=Element14; ComponentLink4URL: https://datasheet.ciiva.com/22643/1635184-22643438.pdf?src-supplier=Element14; ComponentLink4Description: https://datasheet.ciiva.com/22643/1635184-22643438.pdf?src-supplier=Element14; ComponentLink5URL: https://datasheet.ciiva.com/7172/1635184-7172907.pdf?src-supplier=Newark; ComponentLink5Description: https://datasheet.ciiva.com/7172/1635184-7172907.pdf?src-supplier=Newark; ComponentLink6URL: https://datasheet.ciiva.com/16208/dcrcwe3-16208758.pdf?src-supplier=Future+Electronics; ComponentLink6Description: https://datasheet.ciiva.com/16208/dcrcwe3-16208758.pdf?src-supplier=Future+Electronics; Supplier 1: Digikey; Supplier Part Number 1: 541-49.9KABCT-ND
R359 = CRCW02010000Z0ED: Fixed Resistor, Metal Glaze/thick Film, 0.05W, 0ohm, Surface Mount, 0201; Manufacturer: Vishay; Medical Grade MFR: Mini-Systems; Medical Grade MFR PN: MWA96SM-0000F-NS62TR; Power: 50mW; Rated Temperature: 70°C; Package Height: 0.23mm; Package Length: 0.6mm; Package Width: 0.3mm; Reference Standard: AEC-Q200; Category: Chip SMD Resistors; Supplier: Digikey; Supplier Part Number: 541-0.0AGCT-ND; Manufacturer Part Number: CRCW02010000Z0ED; RoHS: Yes; Stock: 701366; Pricing: 1=0,1, 10=0,034, 25=0,026, 50=0,0198, 100=0,0138, 250=0,01112, 500=0,0089, 1000=0,00655, 5000=0,0047 (USD); Mounting Technology: Surface Mount; Pins: 2; Package Shape: Rectangular; Case/Package: 0201; Terminal Finish: Nickel; Min Operating Temperature: -55°C; Max Operating Temperature: 155°C; JESD-609 Code: e3; Resistor Type: FIXED RESISTOR; Construction: Chip; Package Style: SMTMeter; Packaging: Tape and Reel; Technology: METAL GLAZE/THICK FILM; Termination: Wraparound; Reach SVHC Compliant: Yes; RoHS Compliant: Yes; ComponentLink1URL: https://datasheet.ciiva.com:443/pdfs/VipMasterIC/IC/VISH/VISH-S-A0002932828/VISH-S-A0002932828-1.pdf?src-supplier=IHS+Markit; ComponentLink1Description: https://datasheet.ciiva.com:443/pdfs/VipMasterIC/IC/VISH/VISH-S-A0002932828/VISH-S-A0002932828-1.pdf?src-supplier=IHS+Markit; ComponentLink2URL: https://datasheet.ciiva.com/2471/crcw0201e3-2471712.pdf?src-supplier=Digikey; ComponentLink2Description: https://datasheet.ciiva.com/2471/crcw0201e3-2471712.pdf?src-supplier=Digikey; ComponentLink3URL: https://datasheet.ciiva.com/7841/1719906-7841431.pdf?src-supplier=Element14; ComponentLink3Description: https://datasheet.ciiva.com/7841/1719906-7841431.pdf?src-supplier=Element14; ComponentLink4URL: https://datasheet.ciiva.com/7841/1719906-7841430.pdf?src-supplier=Element14; ComponentLink4Description: https://datasheet.ciiva.com/7841/1719906-7841430.pdf?src-supplier=Element14; ComponentLink5URL: https://datasheet.ciiva.com/22665/1847332-22665688.pdf?src-supplier=Element14; ComponentLink5Description: https://datasheet.ciiva.com/22665/1847332-22665688.pdf?src-supplier=Element14; ComponentLink6URL: https://datasheet.ciiva.com/2471/crcw0201e3-2471713.pdf?src-supplier=Digikey; ComponentLink6Description: https://datasheet.ciiva.com/2471/crcw0201e3-2471713.pdf?src-supplier=Digikey; ComponentLink7URL: https://datasheet.ciiva.com/2471/crcw0201e3-2471711.pdf?src-supplier=Digikey; ComponentLink7Description: https://datasheet.ciiva.com/2471/crcw0201e3-2471711.pdf?src-supplier=Digikey; ComponentLink8URL: https://datasheet.ciiva.com/16757/70202042-16757849.pdf?src-supplier=Allied+Electronics; ComponentLink8Description: https://datasheet.ciiva.com/16757/70202042-16757849.pdf?src-supplier=Allied+Electronics; ComponentLink9URL: https://datasheet.ciiva.com/16436/crcw0201e3-16436237.pdf?src-supplier=Future+Electronics; ComponentLink9Description: https://datasheet.ciiva.com/16436/crcw0201e3-16436237.pdf?src-supplier=Future+Electronics; Supplier 1: Digikey; Supplier Part Number 1: 541-0.0AGDKR-ND
TP300 TP302 TP308-TP314 TP316 TP319-TP321 = Test Point: Test pad, 0.90mm circular pad; PCB Footprint: testpad_0p90mm; Length (mm): 0.90; Manufacturer: N/A; Manufacturer PN: N/A; Medical Grade MFR: N/A; Medical Grade MFR PN: N/A; Rating: N/A; Thickness (mm): N/A; Value: Test point; Width (mm): 0.90; Category: Test point; Status: *; Review: *
U300 U302 U313 U314 = AD8505ACBZ-R7: Op Amp, Rail-to-Rail, 95kHz, WLCSP-6; Medical Grade MFR: TBD; Rating: 5.5V; Category: IC; Length (mm): 1.39 ±0.04; Medical Grade MFR PN: TBD; PCB Footprint: TBD; Thickness (mm): 0.56 ±0.05; Width (mm): 0.90 ±0.04; Package Description: TBD; Supplier 1: Digi-Key; Supplier Part Number 1: AD8505ACBZ-R7CT-ND; Status: *; Review: *; Manufacturer Part Number: AD8505ACBZ-R7; Value: AD8505ACBZ-R7
U315 = LTC3130IUDC-1#PBF: Buck-Boost Converter, Selectable Voltage, QFN-20; Medical Grade MFR: TBD; Rating: 25V; Category: IC; Length (mm): 4.00 ±0.10; Medical Grade MFR PN: TBD; PackageDescription: TBD; PCB Footprint: TBD; Thickness (mm): 0.75 ±0.05; Value: LTC3130IUDC-1#PBF; Width (mm): 3.00 ±0.10; Supplier 1: Digi-Key; Supplier Part Number 1: LTC3130IUDC-1#PBF-ND; Status: *; Review: *; Manufacturer Part Number: LTC3130IUDC-1#PBF